# Altium schematic sheet sch.SchDoc
size A4
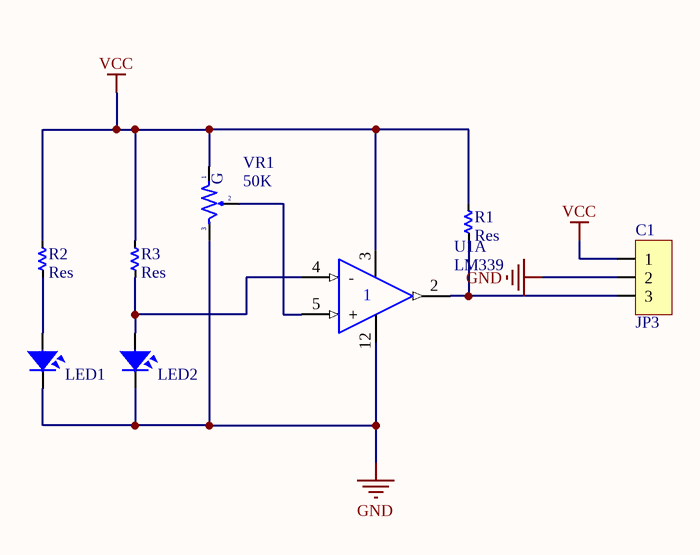
[diagram p0: sch.SchDoc]

## Parts
C1  JP3  [JP3-C1T]
LED1  LED  [LED-5-WHITE]  (value not drawn)
LED2  LED  [LED-5-WHITE]  (value not drawn)
R1  Res  [RES-1/4W-SMALL]
R2  Res  [RES-1/4W-SMALL]
R3  Res  [RES-1/4W-SMALL]
U1  LM339  [DIP14]  (part A of 4)
VR1  50K  [VR-S1]

## Nets
GND: C1.2 LED1.2 LED2.2 U1.12(GND) VR1.3
VCC: C1.1 R1.1 R2.1 R3.1 U1.3(VCC) VR1.1
NetC1_3: C1.3 R1.2 U1.2(OUT)
NetLED1_1: LED1.1 R2.2
NetLED2_1: LED2.1 R3.2 U1.4(-)
NetU1_5: U1.5(+) VR1.2

## Notes on the sheet
- Title
- Size:
- Date:
- A4
- Number:
- Time:
- Revision:
- Sheet
- of
- File:
- (in symbol VR-S) G

## Library data of the parts
C1 = JP3: WR-PHD 2.54 mm Angled Socket Header; Manufacturer: W¨¹rth Elektronik eiSos GmbH; partNo: 613003143121; ComponentLink1 Description: Manufacturer; ComponentLink2 Description: Datasheet; NoPins: 03; Created Date: 29 March 2013; ComponentLink1URL: http://www.we-online.com; ComponentLink2URL: http://katalog.we-online.de/em/datasheet/6130xx143121.pdf; Created by: Karrer Zheng
LED1 LED2 = LED: LED Single colour Green and Red; Value: LED 3 ly Single Colour
R1-R3 = Res: Manufacturer: Generic Components; Class: Passive; SubClass: R; Published: 08/06/2000; Publisher: Altium Hobart Technology Centre
U1 = LM339: Low Power Low Offset Voltage Quad Comparators
VR1 = VR-S: Var Resistor; Value: Volume 50k